# EAGLE schematic led-driver (EAGLE 9.6.2)
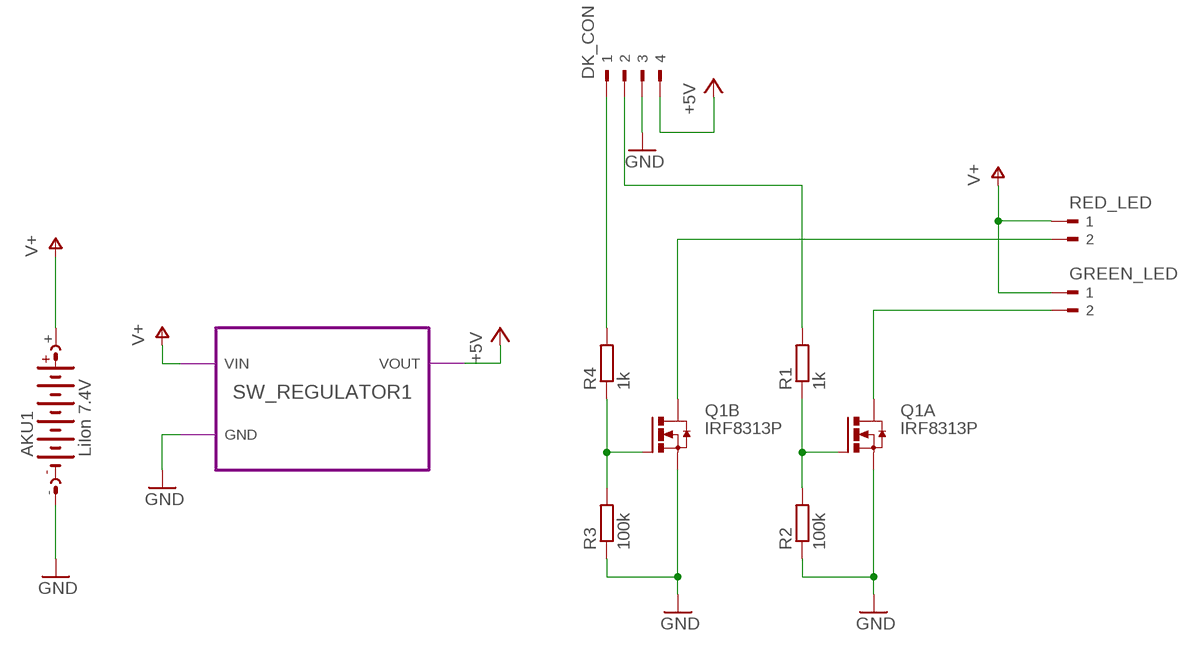
[diagram p0: schematic, sheet 1]

## Parts
AKU1  LiIon 7.4V  AB9V  [AB9V]
DK_CON  90-4  [90-4]
GREEN_LED  90-2  [90-2]
Q1  IRF8313P  [SO-08]
R1  1k  R-EU_R0603  [R0603]
R2  100k  R-EU_R0603  [R0603]
R3  100k  R-EU_R0603  [R0603]
R4  1k  R-EU_R0603  [R0603]
RED_LED  90-2  [90-2]

## Module instances
SW_REGULATOR1 = SW_REGULATOR

## Nets
+5V: DK_CON.4 ; port SW_REGULATOR1.VOUT
GND: AKU1.- DK_CON.3 Q1.1(B:S) Q1.3(A:S) R2.1 R3.1 ; port SW_REGULATOR1.GND
N$1: Q1.2(B:G) R3.2 R4.1
N$2: Q1.4(A:G) R1.1 R2.2
N$3: GREEN_LED.2 Q1.5(A:D) Q1.6(A:D)
N$4: Q1.7(B:D) Q1.8(B:D) RED_LED.2
N$5: DK_CON.1 R4.2
N$6: DK_CON.2 R1.2
V+: AKU1.+ GREEN_LED.1 RED_LED.1 ; port SW_REGULATOR1.VIN

## Library data of the parts
AKU1 = battery:AB9V: 9-V BATTERY CLIP
DK_CON = con-weidmueller-sl35:90-4: WEIDMUELLER CLAMP CONNECTOR; OC_FARNELL: unknown; OC_NEWARK: unknown
GREEN_LED RED_LED = con-weidmueller-sl35:90-2: WEIDMUELLER CLAMP CONNECTOR; OC_FARNELL: unknown; OC_NEWARK: unknown
Q1 = transistor-power:IRF8313P: HEXFET(R) Power MOSFET Source: Data sheet <http://www.irf.com/product-info/datasheets/data/irf8313pbf.pdf>
R1-R4 = rcl:R-EU_: RESISTOR, European symbol; SPICEPREFIX: R

## Module SW_REGULATOR
Ports: GND(io) VIN(io) VOUT(io)

### Library data of the parts